# Altium schematic sheet PRUC-Voltmeter_USB-UART-Converter.SchDoc: USB-UART Converter
size A4; SheetNumber: 5; SheetTotal: 9
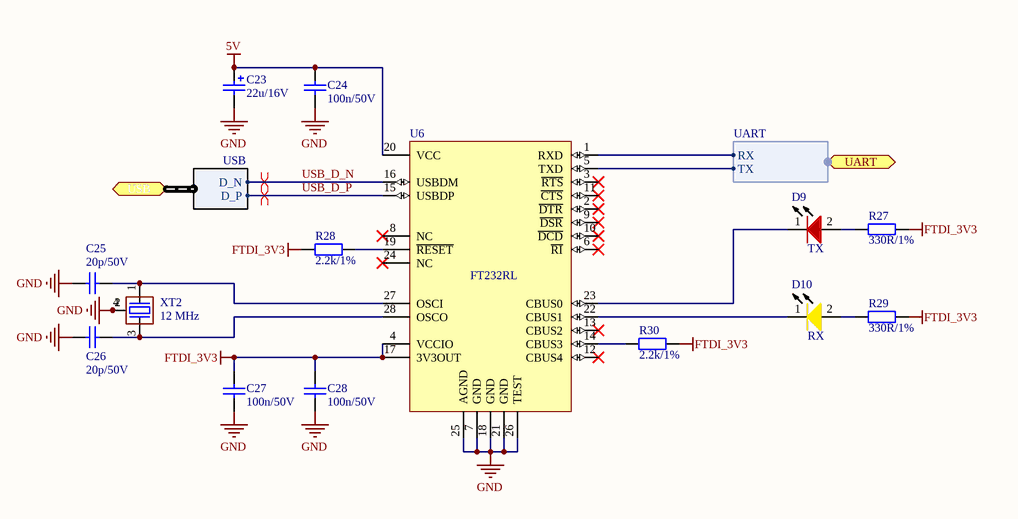
[diagram p0: PRUC-Voltmeter_USB-UART-Converter.SchDoc]

## Parts
C23  22u/16V  [Tantalum_B]
C24  100n/50V  [MLCC_0805]
C25  20p/50V  [MLCC_0603]
C26  20p/50V  [MLCC_0603]
C27  100n/50V  [MLCC_0805]
C28  100n/50V  [MLCC_0805]
D9  TX  [LED_0805_R]
D10  RX  [LED_0805_Y]
R27  330R/1%  [R_0603]
R28  2.2k/1%  [R_0603]
R29  330R/1%  [R_0603]
R30  2.2k/1%  [R_0603]
U6  FT232RL  [TSSOP-28_M]
XT2  12 MHz  [ABM3B]

## Ports
UART (harness UART), USB (harness USB)

## Harnesses
UART: TX, RX
USB: D_P, D_N

## Nets
5V: C23.1 C24.1 U6.20(VCC)
FTDI_3V3: C27.1 C28.1 R27.2 R28.2 R29.2 R30.2 U6.4(VCCIO) U6.17(3V3OUT)
GND: C23.2 C24.2 C25.1 C26.1 C27.2 C28.2 U6.7(GND) U6.18(GND) U6.21(GND) U6.25(AGND) U6.26(TEST) XT2.2(GND) XT2.4(GND)
USB_D_N: U6.16(USBDM) ; port USB.D_N
USB_D_P: U6.15(USBDP) ; port USB.D_P
NetC25_2: C25.2 U6.27(OSCI) XT2.1(inp)
NetC26_2: C26.2 U6.28(OSCO) XT2.3(out)
NetD9_1: D9.1(K) U6.23(CBUS0)
NetD9_2: D9.2(A) R27.1
NetD10_1: D10.1(K) U6.22(CBUS1)
NetD10_2: D10.2(A) R29.1
NetR28_1: R28.1 U6.19(~{RESET})
NetR30_1: R30.1 U6.14(CBUS3)
NetU6_1: U6.1(RXD) ; port UART.RX
NetU6_5: U6.5(TXD) ; port UART.TX

Not connected (* = marked no-connect by the designer): U6 2(~{DTR})* 3(~{RTS})* 6(~{RI})* 8(NC)* 9(~{DSR})* 10(~{DCD})* 11(~{CTS})* 12(CBUS4)* 13(CBUS2)* 24(NC)*

## Layout directives
differential pair: USB_D_N, USB_D_P

## Notes on the sheet
- Project:
- Title:
- Variant Name:
- Author:
- Checked by:
- Ver/Rev:
- Date:
- Approved by:
- Sheet:
- of
- File name:

## Library data of the parts
C23 = TAJB226K016R: Manufacturer: AVX; Manufacturer Part Number: TAJB226K016RNJ; Part Description: TAJ Series AVX Solid Tantalum Capacitor; Index: 23; Part Number: TAJB226K016R; Value: 22u/16V; SMD: true; Supplier 1: TME; Supplier Part Number 1: TAJB226K016R; HelpURL: https://www.tme.eu/pl/Document/85f84849ee9dc6997647a15c8c95a9d3/taj.pdf; Category: Capacitors
C24 C27 C28 = CL21B104JBCNNNC: Manufacturer: Samsung; Part Description: 0805 General Multilayer Ceramic Capacitor; Index: 36; Part Number: CL21B104JBCNNNC; Value: 100n/50V; SMD: true; Manufacturer Part Number: CL21B104JBCNNNC; Supplier 1: TME; Supplier Part Number 1: CL21B104JBCNNNC; HelpURL: https://www.tme.eu/Document/4a42202b32dab16128fe107dd69598cc/samsung-chip-cap.pdf; Category: Capacitors
C25 C26 = CL10C200JB8NNNC: Manufacturer: Samsung; Part Description: 0603 General Multilayer Ceramic Capacitor; Index: 57; Part Number: CL10C200JB8NNNC; Value: 20p/50V; SMD: true; Manufacturer Part Number: CL10C200JB8NNNC; Supplier 1: TME; Supplier Part Number 1: CL10C200JB8NNNC; HelpURL: https://www.tme.eu/Document/7da762c1dbaf553c64ad9c40d3603826/mlcc_samsung.pdf; Category: Capacitors
D9 = OSR50805C1E: Manufacturer: OptoSupply; Part Description: 0805 Chip LED Red; Index: 25; Value: Red; Part Number: OSR50805C1E; SMD: true; Manufacturer Part Number: OSR50805C1E; Supplier 1: TME; Supplier Part Number 1: OSR50805C1E; HelpURL: https://www.tme.eu/pl/Document/6f99baddc8b38eb1a865ea6b78250b2b/OSXX0805C1E-DTE.pdf; Category: Diodes
D10 = OSY50805C1E: Manufacturer: OptoSupply; Part Description: 0805 Chip LED Yellow; Index: 27; Value: Yellow; Part Number: OSY50805C1E; SMD: true; Manufacturer Part Number: OSY50805C1E; Supplier 1: TME; Supplier Part Number 1: OSY50805C1E; HelpURL: https://www.tme.eu/pl/Document/6f99baddc8b38eb1a865ea6b78250b2b/OSXX0805C1E-DTE.pdf; Category: Diodes
R27 R29 = 0603SAF3300T5E: Manufacturer: Royalohm; Part Description: 0603 Thick Film Chip Resistor; Index: 119; Part Number: 0603SAF3300T5E; Value: 330R/1%; SMD: true; Manufacturer Part Number: 0603SAF3300T5E; Supplier 1: TME; Supplier Part Number 1: SMD0603-330R-1%; HelpURL: https://www.tme.eu/pl/Document/b315665a56acbc42df513c99b390ad98/ROYALOHM-THICKFILM.pdf; Category: Resistors
R28 R30 = 0603SAF2201T5E: Manufacturer: Royalohm; Part Description: 0603 Thick Film Chip Resistor; Index: 15; Part Number: 0603SAF2201T5E; Value: 2.2k/1%; SMD: true; Manufacturer Part Number: 0603SAF2201T5E; Supplier 1: TME; Supplier Part Number 1: 0603SAF2201T5E; HelpURL: https://www.tme.eu/pl/Document/b315665a56acbc42df513c99b390ad98/ROYALOHM-THICKFILM.pdf; Category: Resistors
U6 = FT232RL: Manufacturer: FTDI; Part Description: FTDI USB UART converter; Index: 21; Value: 1ch; Part Number: FT232RL; SMD: true; Manufacturer Part Number: FT232RL; Supplier 1: TME; Supplier Part Number 1: FT232RL; HelpURL: https://www.tme.eu/Document/c3c4deb3631c144a10809782a3ee19f2/FT232RQ.pdf; Category: Interfaces
XT2 = ABM3B-12.000MHZ-B2-T: Manufacturer: ABRACON; Part Description: Ceramic SMD Crystal; Index: 96; Part Number: ABM3B-12.000MHZ-B2-T; Value: 12 MHz; SMD: true; Manufacturer Part Number: ABM3B-12.000MHZ-B2-T; Supplier 1: TME; Supplier Part Number 1: ABM3B-12.000MHZ-B2; HelpURL: https://www.tme.eu/Document/a887f863d547643a986feb1a84bac6c0/abm3b.pdf; Category: Crystal